# EasyEDA Pro project ProProject_Kame Quadrapot_2024-12-26.epro, board PCB1_1
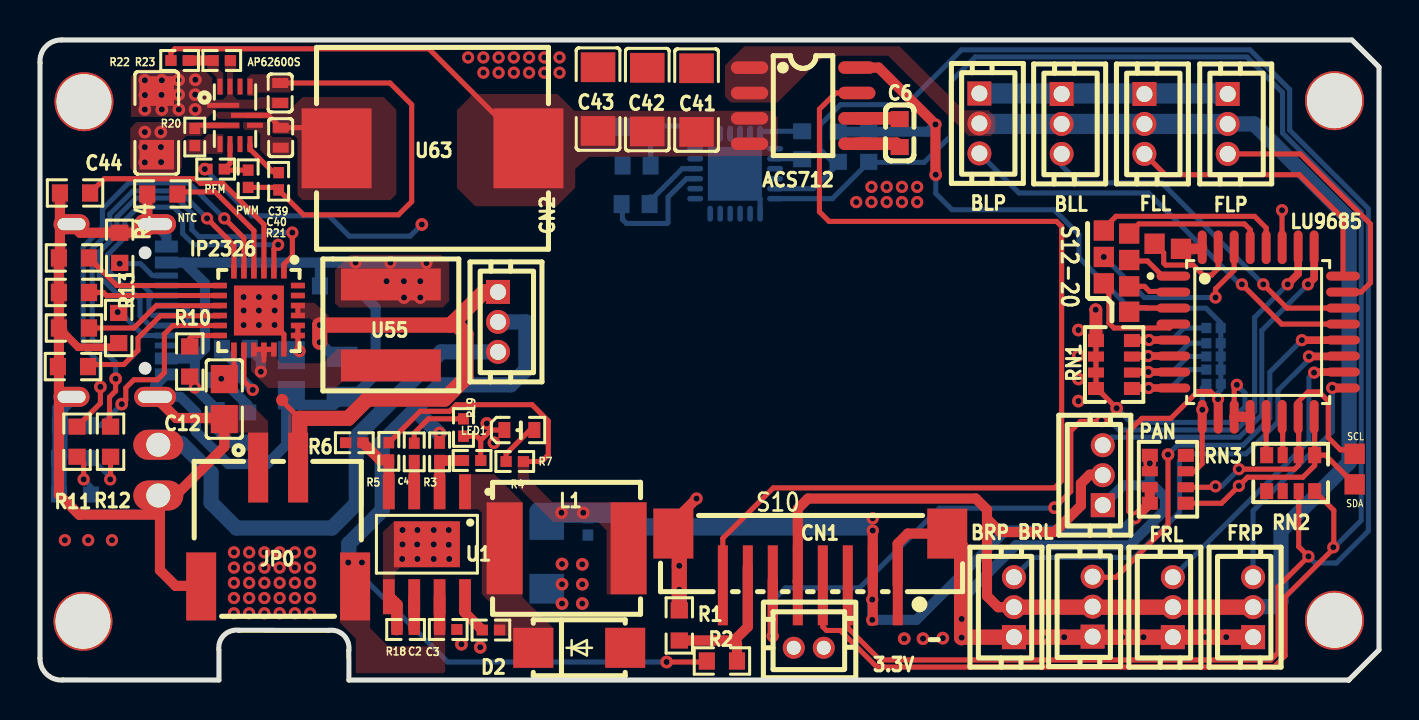
[diagram p5: board, top side]
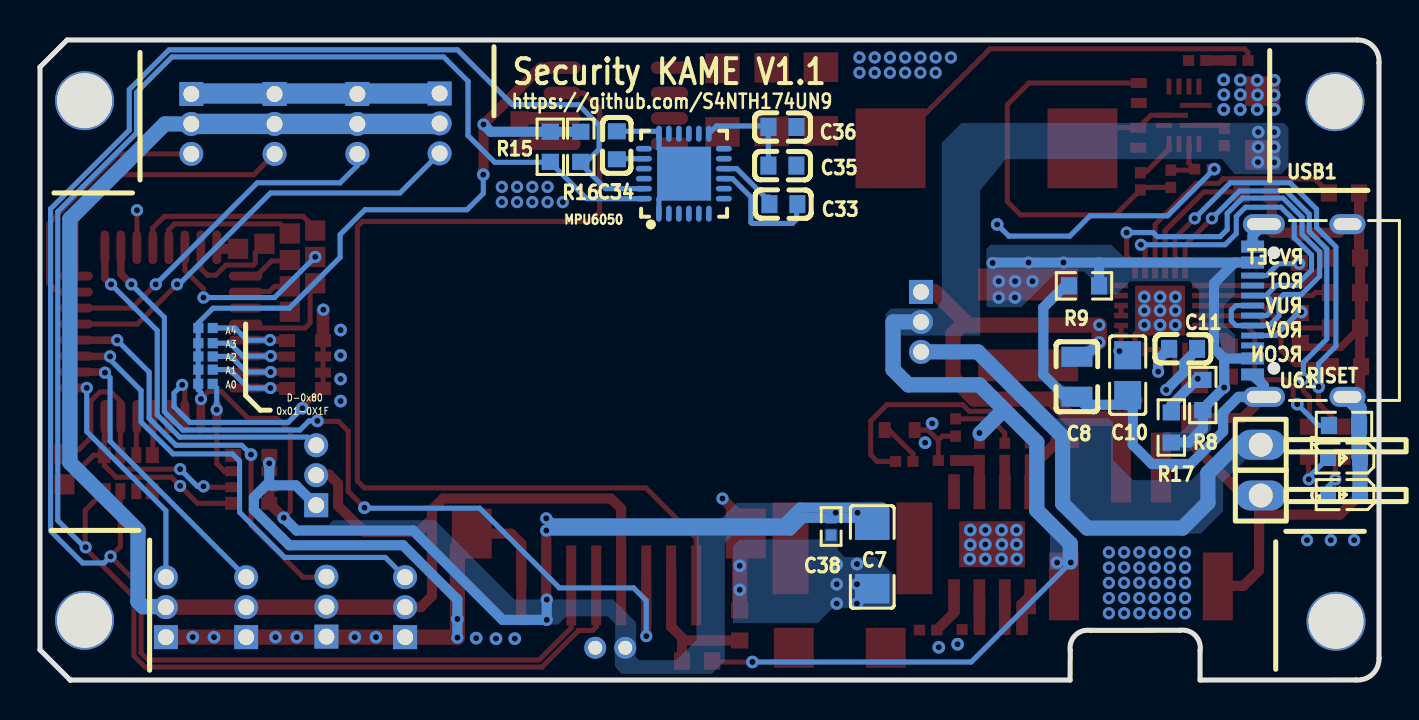
[diagram p6: board, bottom side, seen from below]

Outline 66.98 x 32.03 mm; copper layers: Top Layer, Bottom Layer. Coordinates in mm from the lower left corner of the outline.
Outline path: 65.47,0 15.45,0 15.45,1.49 arc(15.2,2.24) 14.45,2.49 9.95,2.49 arc(9.2,2.24) 8.95,1.49 8.95,0 1.14,0 arc(0.33,0.29) 0,1.09 0,30.89 arc(0.29,31.7) 1.09,32.03 65.62,32.03 66.98,30.67 66.98,1.51 65.47,0 ; 65.47,0 65.44,0
Stack: Top Layer 0.035mm - / Dielectric1 1.51mm FR4 er 4.5 / Bottom Layer 0.035mm -

## Design rules (mm)
template: Custom Config
spacing copperThickness1oz (default): track to track 0.102, other pairs 0.051 to 0.3
spacing copperThickness2oz: track to track 0.203, other pairs 0.152 to 0.3
track width copperThickness1oz (default): min 0.127, default 0.254, max 2.54
track width copperThickness2oz: min 0.203, default 0.254, max 2.54
differential pair differentialPair (default): width min 0.127, default 0.254, max 2.54; gap min 0.152, default 0.152
via viaSize (default): diameter min 0.5, default 0.61, max 10; hole min 0.3, default 0.305, max 6.299
net P_GND uses copperRegion1

## Placement (name value [footprint] x y rotation side)
3.3V  ZH1.5-2A  [CONN-TH_ZH-1.5-2A]  38.45 1.61 0 top
ACS712  ACS712ELCTR-05B-T-JSM  [SOP-8_L4.9-W3.9-P1.27-LS6.0-BL]  38.18 28.74 270 top
AP62600S  AP62600SJ-7  [QFN-12_L3.0-W2.0-P0.50-TL_AP62600SJ-7]  9.88 28.26 0 top
BLL  ZH1.5-3A  [CONN-TH_ZH1.5-3A_C2829733]  51.1 27.83 270 top
BLP  ZH1.5-3A  [CONN-TH_ZH1.5-3A_C2829733]  46.99 27.85 270 top
BRL  ZH1.5-3A  [CONN-TH_ZH1.5-3A_C2829733]  52.65 3.67 90 top
BRP  ZH1.5-3A  [CONN-TH_ZH1.5-3A_C2829733]  48.72 3.65 90 top
C2  10uF  [R0402]  20.42 2.53 180 top
C3  100nF  [R0402]  22.55 2.5 180 top
C4  220pF  [R0402]  18.72 11.42 270 top
C6  1nF  [C0603]  43 27.37 270 top
C7  22uF  [C1206]  25.35 6.16 90 bottom
C8  10uF  [C0805#2]  15.11 15.18 270 bottom
C10  22uF  [C0805]  12.57 15.25 270 bottom
C11  100nF  [C0603]  9.8 16.57 180 bottom
C12  10uF  [C0805]  9.22 14.06 90 top
C33  1u  [C0603]  29.79 23.81 180 bottom
C34  1u  [C0603]  38.12 26.76 90 bottom
C35  10u  [C0603]  29.84 25.74 0 bottom
C36  1u  [C0603]  29.84 27.67 0 bottom
C38  100nF  [R0402]  27.41 7.68 90 bottom
C39  1uF  [C0402]  12.01 29.38 270 top
C40  100nF  [C0402]  12.04 27.14 270 top
C41  22uF  [C1206]  32.84 29.02 270 top
C42  22uF  [C1206]  30.38 29.05 270 top
C43  22uF  [C1206]  27.91 29.07 270 top
C44  22uF  [C1206]  5.84 27.88 270 top
CN1  8PIN_SMT(1.25MM)  [CONN-SMD_8PIN_SMT-P1.25]  38.53 6.03 180 top
CN2  -  [CONN-TH_ZH1.5-3A_C2829733]  22.91 17.92 270 top
D2  SS34BF  [DO-214AC_L4.3-W2.7-LS5.2-RD]  26.97 1.61 0 top
FLL  ZH1.5-3A  [CONN-TH_ZH1.5-3A_C2829733]  55.24 27.83 270 top
FLP  ZH1.5-3A  [CONN-TH_ZH1.5-3A_C2829733]  59.41 27.83 270 top
FRL  ZH1.5-3A  [CONN-TH_ZH1.5-3A_C2829733]  56.67 3.65 90 top
FRP  ZH1.5-3A  [CONN-TH_ZH1.5-3A_C2829733]  60.68 3.65 90 top
G  LedRed_0603  [LED0603-RD_RED]  1.75 9.28 0 bottom
IP2326  IP2326_NPD  [QFN-24_L4.0-W4.0-P0.50-BL-EP2.5]  10.95 18.49 180 top
JP0  HDR-1X2  [CONN-SMD_PH2.0MM-2AWB]  11.91 7.66 0 top
L1  10uH  [IND-SMD_L7.4-W6.6_ECS-MPIL0630]  26.34 6.59 0 top
LED1  0603  [LED0603-R-RD_MINI]  23.98 12.51 0 top
LU9685  LU9685-20CU  [LQFP-32_L7.0-W7.0-P0.80-LS9.0-BL]  60.93 17.41 270 top
MPU6050  MPU6050-YJLTY  [QFN-24_L4.0-W4.0-P0.50-BL-EP2.7]  34.77 25.34 180 bottom
NOREF  -  [Pad_e13528]  58.34 15.53 180 top
NOREF#2  -  [Pad_e13532]  58.34 16.85 180 top
NOREF#3  -  [Pad_e13531]  59.06 16.19 180 top
NOREF#4  -  [Pad_e2339]  54.48 18.43 180 top
NOREF#5  -  [Pad_e75]  64.75 2.99 0 top
NOREF#6  -  [Pad_e2336]  54.48 21.02 180 top
NOREF#7  -  [Pad_e73]  2.15 2.94 0 top
NOREF#8  -  [Pad_e71]  2.2 28.94 0 top
NOREF#9  -  [Pad_e2335]  53.21 21.17 180 top
NOREF#10  -  [Pad_e13533]  59.06 16.85 180 top
NOREF#11  -  [Pad_e2310]  54.48 22.34 180 top
NOREF#12  -  [Pad_e2378]  65.76 9.79 180 top
NOREF#13  -  [Pad_e2297]  53.21 22.49 180 top
NOREF#14  -  [Pad_e2337]  53.21 19.85 180 top
NOREF#15  -  [Pad_e13535]  59.06 17.62 180 top
NOREF#16  -  [Pad_e13526]  59.06 14.82 180 top
NOREF#17  -  [Pad_e77]  64.75 28.99 0 top
NOREF#18  -  [Pad_e13530]  58.34 16.19 180 top
NOREF#19  -  [Pad_e13525]  58.34 14.82 180 top
NOREF#20  -  [Pad_e13534]  58.34 17.62 180 top
NOREF#21  -  [Pad_e2405]  12.11 14.01 0 top
NOREF#22  -  [Pad_e2377]  65.76 11.32 180 top
NOREF#23  -  [Pad_e2321]  55.75 21.83 180 top
NOREF#24  -  [Pad_e2338]  54.48 19.7 180 top
NOREF#25  -  [Pad_e13529]  59.06 15.53 180 top
NOREF#26  -  [Pad_e2322]  57.07 21.58 180 top
NTC  51KΩ  [R0603]  6.12 24.32 0 top
PAN  ZH1.5-3A  [CONN-TH_ZH1.5-3A_C2829733]  53.16 10.25 90 top
PFM  JP  [R0402]  8.79 25.57 0 top
PWM  JP  [R0402]  10.41 25.08 270 top
R  LedGreen_0603  [LED0603-RD_GREEN]  1.75 11.11 0 bottom
R1  10kΩ  [R0603]  31.98 2.73 90 top
R2  15kΩ  [R0603]  34.11 0.95 0 top
R3  24K  [R0402]  19.99 11.42 270 top
R4  100K  [R0402]  21.61 10.99 0 top
R5  3V3=124/40.2  [R0402]  17.45 11.44 270 top
R6  40.2K  [R0402]  15.72 11.88 180 top
R7  2K2  [R0402]  23.75 10.94 180 top
R8  1Ω  [R0603]  8.81 14.26 270 bottom
R9  5.1kΩ  [R0603]  14.76 19.72 180 bottom
R10  5.1kΩ  [R0603]  7.49 15.94 90 top
R11  1kΩ  [R0603]  1.85 11.93 90 top
R12  1kΩ  [R0603]  3.53 11.93 90 top
R13  5.1kΩ  [R0603]  3.94 17.62 270 top
R14  5.1kΩ  [R0603]  3.99 21.63 270 top
R15  2.2K  [R0603]  41.45 26.68 90 bottom
R16  2.2K  [R0603]  39.93 26.68 90 bottom
R17  1Ω  [R0603]  10.39 12.64 270 bottom
R18  200K  [R0402]  18.29 2.53 180 top
R19  68.1K  [R0402]  21.18 12.64 270 top
R20  100k  [R0402]  7.74 27.17 270 top
R21  100k  [R0402]  11.94 24.96 90 top
R22  221k  [R0402]  6.98 31 0 top
R23  30.1k  [R0402]  9.09 31 0 top
RCON  1k  [R0603]  1.65 15.68 0 top
RISET  75k  [R0603]  1.75 12.74 0 bottom
RN1  4.7kΩ  [RES-ARRAY-SMD_0603-8P-L3.2-W1.6-BL]  53.72 15.79 270 top
RN2  220Ω  [RES-ARRAY-SMD_0603-8P-L3.2-W1.6-BL]  62.56 10.35 0 top
RN3  4.7kΩ  [RES-ARRAY-SMD_0603-8P-L3.2-W1.6-BL]  56.41 10.05 270 top
ROT  120K  [R0603]  1.7 21.12 0 top
ROV  NC  [R0603]  1.7 17.62 0 top
RUV  1k  [R0603]  1.7 19.39 0 top
RVSET  NC  [R0603]  1.75 24.37 180 top
U1  MP1584EN-LF-Z  [SOP-8_L4.9-W3.9-P1.27-LS6.0-BL-EP3.3-2]  19.35 6.8 180 top
U55  2.2uH  [IND-SMD_L6.7-W6.5]  17.55 17.77 90 top
U61  PH2.0-2P  [2.54mm_1*2P_oval]  5.92 9.23 0 bottom
U63  1.5uH  [IND-SMD_L11.6-W10.1]  19.63 26.61 0 top
USB1  TYPEC-304A-ACP16O  [USB-SMD_TYPEC-304A-ACP16O]  3.95 18.49 90 bottom

## Footprints (pads in the part's own frame, mm; a bottom-side part is the same pattern mirrored in y, then rotated)
2.54mm_1*2P_oval
  oval 2.5x1.5 hole 1.2: 1(0,0) 2(0,-2.54)
C0402
  rect 0.5x0.8 smd: 1(-0.5,0) 2(0.5,0)
C0603
  rect 0.8x0.9 smd: 1(-0.7,0) 2(0.7,0)
C0805
  rect 1.41x1.35 smd: 1(-1,0) 2(1,0)
C0805#2
  rect 1x1.55 smd: 1(-1,0) 2(1,0)
C1206
  rect 1.485x1.728 smd: 1(-1.593,0) 2(1.593,0)
CONN-SMD_8PIN_SMT-P1.25
  rect 0.5x4 smd: 1(-4.375,1.295) 2(-3.125,1.295) 3(-1.875,1.295) 4(-0.625,1.295) 5(0.625,1.295) 6(1.875,1.295) 7(3.125,1.295) 8(4.375,1.295)
  rect 2x2.5 smd: 9(6.85,-1.295) 10(-6.85,-1.295)
CONN-SMD_PH2.0MM-2AWB
  rect 1x3.5 smd: 1(-1,2.975) 2(1,2.975)
  rect 1.5x3.4 smd: 3(3.85,-2.975) 4(-3.85,-2.975)
CONN-TH_ZH1.5-3A_C2829733
  rect 1.2x1.2 hole 0.8: 1(-1.5,0)
  round 1.2 hole 0.8: 2(0,0) 3(1.5,0)
CONN-TH_ZH-1.5-2A
  round 1.1 hole 0.7: 1(-0.75,0) 2(0.75,0)
DO-214AC_L4.3-W2.7-LS5.2-RD
  rect 2x2 smd: 1(-2.3,0) 2(2.3,0)
IND-SMD_L6.7-W6.5
  rect 1.6x5 smd: 1(-2.025,0) 2(2.025,0)
IND-SMD_L7.4-W6.6_ECS-MPIL0630
  rect 1.8x4.6 smd: 1(-3.1,0) 2(3.1,0)
IND-SMD_L11.6-W10.1
  rect 3.5x4 smd: 1(-4.8,0) 2(4.8,0)
LED0603-R-RD_MINI
  rect 0.6x0.8 smd: 1(0.75,0) 2(-0.75,0)
LED0603-RD_GREEN
  rect 0.8x0.8 smd: 1(-0.799,-0.004) 2(0.799,0.004)
LED0603-RD_RED
  rect 0.8x0.8 smd: 1(-0.799,-0.004) 2(0.799,0.004)
LQFP-32_L7.0-W7.0-P0.80-LS9.0-BL
  oval 0.448x1.684 smd: 1(-2.8,-4.242) 2(-2,-4.242) 3(-1.2,-4.242) 4(-0.4,-4.242) 5(0.4,-4.242) 6(1.2,-4.242) 7(2,-4.242) 8(2.8,-4.242) 17(2.8,4.242) 18(2,4.242) 19(1.2,4.242) 20(0.4,4.242) 21(-0.4,4.242) 22(-1.2,4.242) 23(-2,4.242) 24(-2.8,4.242)
  oval 1.684x0.448 smd: 9(4.242,-2.8) 10(4.242,-2) 11(4.242,-1.2) 12(4.242,-0.4) 13(4.242,0.4) 14(4.242,1.2) 15(4.242,2) 16(4.242,2.8) 25(-4.242,2.8) 26(-4.242,2) 27(-4.242,1.2) 28(-4.242,0.4) 29(-4.242,-0.4) 30(-4.242,-1.2) 31(-4.242,-2) 32(-4.242,-2.8)
Pad_e71
  round 2.95 hole 2.75: 1(0,0)
Pad_e73
  round 2.95 hole 2.75: 2(0,0)
Pad_e75
  round 2.95 hole 2.75: 4(0,0)
Pad_e77
  round 2.95 hole 2.75: 3(0,0)
Pad_e2297
  rect 1.016x1.016 smd: 6(0,0)
Pad_e2310
  rect 1.016x1.016 smd: 6(0,0)
Pad_e2321
  rect 1.016x1.016 smd: 6(0,0)
Pad_e2322
  rect 1.016x1.016 smd: 6(0,0)
Pad_e2335
  rect 1.016x1.016 smd: 6(0,0)
Pad_e2336
  rect 1.016x1.016 smd: 6(0,0)
Pad_e2337
  rect 1.016x1.016 smd: 6(0,0)
Pad_e2338
  rect 1.016x1.016 smd: 6(0,0)
Pad_e2339
  rect 1.016x1.016 smd: 6(0,0)
Pad_e2377
  rect 1.016x1.016 smd: 6(0,0)
Pad_e2378
  rect 1.016x1.016 smd: 6(0,0)
Pad_e2405
  round 0.61 smd: TP1(0,0)
Pad_e13525
  rect 0.508x0.508 smd far side: 6(0,0)
Pad_e13526
  rect 0.508x0.508 smd far side: 6(0,0)
Pad_e13528
  rect 0.508x0.508 smd far side: 6(0,0)
Pad_e13529
  rect 0.508x0.508 smd far side: 6(0,0)
Pad_e13530
  rect 0.508x0.508 smd far side: 6(0,0)
Pad_e13531
  rect 0.508x0.508 smd far side: 6(0,0)
Pad_e13532
  rect 0.508x0.508 smd far side: 6(0,0)
Pad_e13533
  rect 0.508x0.508 smd far side: 6(0,0)
Pad_e13534
  rect 0.508x0.508 smd far side: 6(0,0)
Pad_e13535
  rect 0.508x0.508 smd far side: 6(0,0)
QFN-12_L3.0-W2.0-P0.50-TL_AP62600SJ-7
  rect 1.6x0.25 smd: 1(-0.715,0.501) 2(-0.715,-0.499) 8(0.475,0.002)
  rect 0.25x0.8 smd: 3(-0.875,-1.44) 4(-0.375,-1.44) 5(0.125,-1.44) 6(0.625,-1.44) 9(0.625,1.44) 10(0.126,1.44) 11(-0.375,1.44) 12(-0.875,1.44)
  rect 0.8x0.25 smd: 7(0.875,-0.499)
QFN-24_L4.0-W4.0-P0.50-BL-EP2.5
  rect 0.28x0.7 smd: 1(-1.25,-1.95) 2(-0.75,-1.95) 3(-0.25,-1.95) 4(0.25,-1.95) 5(0.75,-1.95) 6(1.25,-1.95) 13(1.25,1.95) 14(0.75,1.95) 15(0.25,1.95) 16(-0.25,1.95) 17(-0.75,1.95) 18(-1.25,1.95)
  rect 0.7x0.28 smd: 7(1.95,-1.25) 8(1.95,-0.75) 9(1.95,-0.25) 10(1.95,0.25) 11(1.95,0.75) 12(1.95,1.25) 19(-1.95,1.25) 20(-1.95,0.75) 21(-1.95,0.25) 22(-1.95,-0.25) 23(-1.95,-0.75) 24(-1.95,-1.25)
  rect 2.5x2.5 smd: 25(0,0)
QFN-24_L4.0-W4.0-P0.50-BL-EP2.7
  oval 0.28x0.8 smd: 1(-1.25,-2) 2(-0.75,-2) 3(-0.25,-2) 4(0.25,-2) 5(0.75,-2) 6(1.25,-2) 13(1.25,2) 14(0.75,2) 15(0.25,2) 16(-0.25,2) 17(-0.75,2) 18(-1.242,2)
  oval 0.8x0.28 smd: 7(2,-1.25) 8(2,-0.75) 9(2,-0.25) 10(2,0.25) 11(2,0.75) 12(2,1.25) 19(-2,1.25) 20(-2,0.75) 21(-2,0.25) 22(-2,-0.25) 23(-2,-0.75) 24(-2,-1.25)
  rect 2.7x2.7 smd: 25(0.013,0)
R0402
  rect 0.566x0.54 smd: 1(-0.433,0) 2(0.433,0)
R0603
  rect 0.806x0.864 smd: 1(-0.753,0) 2(0.753,0)
RES-ARRAY-SMD_0603-8P-L3.2-W1.6-BL
  rect 0.65x0.8 smd: 1(-1.2,-0.9) 4(1.2,-0.9) 5(1.2,0.9) 8(-1.2,0.9)
  rect 0.5x0.8 smd: 2(-0.4,-0.9) 3(0.4,-0.9) 6(0.4,0.9) 7(-0.4,0.9)
SOP-8_L4.9-W3.9-P1.27-LS6.0-BL
  oval 0.63x1.865 smd: 1(-1.905,-2.683) 2(-0.635,-2.683) 3(0.635,-2.683) 4(1.905,-2.683) 5(1.905,2.683) 6(0.635,2.683) 7(-0.635,2.683) 8(-1.905,2.683)
SOP-8_L4.9-W3.9-P1.27-LS6.0-BL-EP3.3-2
  rect 0.589x1.75 smd: 1(-1.905,-2.626) 2(-0.635,-2.626) 3(0.635,-2.626) 4(1.905,-2.626) 5(1.905,2.626) 6(0.635,2.626) 7(-0.635,2.626) 8(-1.905,2.626)
  rect 3.3x2.3 smd: 9(0,0)
USB-SMD_TYPEC-304A-ACP16O
  oval 1x2.1 hole 0.6x1.7: 12(-4.32,1.808) 13(4.32,1.808)
  oval 1x1.8 hole 0.6x1.4: 14(-4.32,-2.373) 15(4.32,-2.373)
  rect 0.6x1.15 smd: A1B12(-3.2,2.373) A4B9(-2.4,2.373) B1A12(3.2,2.373) B4A9(2.4,2.373)
  rect 0.3x1.15 smd: A5(-1.25,2.373) A6(-0.25,2.373) A7(0.25,2.373) A8(1.25,2.373) B5(1.75,2.373) B6(0.75,2.373) B7(-0.75,2.373) B8(-1.75,2.373)

## Nets
5V: ACS712.3 ACS712.4 C41.2 C42.2 C43.2 R22.1 U63.2
+5V: ACS712.1 ACS712.2 BLL.2 BLP.2 BRL.2 BRP.2 CN1.5 FLL.2 FLP.2 FRL.2 FRP.2 PAN.2
DVCC: 3.3V.1 ACS712.8 C7.2 C38.2 CN1.2 L1.2 LU9685.10 NOREF#3.6 NOREF#10.6 NOREF#15.6 NOREF#16.6 NOREF#25.6 R5.1 R7.1 R15.2 R16.2 RN3.3 RN3.4
GND: 3.3V.2
VIN: R8.2 R9.2 R10.1 R17.2 U55.2 USB1.A4B9 USB1.B4A9
A0: LU9685.9 NOREF#19.6 RN3.7
A1: LU9685.8 NOREF.6 RN1.5
A2: LU9685.7 NOREF#18.6 RN1.6
A3: LU9685.6 NOREF#2.6 RN1.7
A4: LU9685.5 NOREF#20.6 RN1.8
BAT: C8.1 CN2.1 IP2326.21 IP2326.22 JP0.2 NOREF#21.TP1
BAT+: AP62600S.2 C2.2 C44.2 CN2.2 JP0.3 R2.1 R3.1 R20.1 U1.7
BT_SENSE: CN1.7 R1.1 R2.2
CUR_SEN: ACS712.7 CN1.8
DJ0: FRP.3 LU9685.17
DJ1: FRL.3 LU9685.18
DJ2: BRP.3 LU9685.19
DJ3: BRL.3 LU9685.20
DJ4: BLP.3 LU9685.21
DJ5: BLL.3 LU9685.22
DJ6: FLP.3 LU9685.23
DJ7: FLL.3 LU9685.24
DJ8: LU9685.25 PAN.3
DJ9: CN1.6 LU9685.26
DJ10: LU9685.27
DJ11: LU9685.28 NOREF#13.6
DJ12: LU9685.29 NOREF#11.6
DJ13: LU9685.30 NOREF#9.6
DJ14: LU9685.31 NOREF#23.6
DJ15: LU9685.32 NOREF#26.6
DJ16: LU9685.1 NOREF#6.6
DJ17: LU9685.2 NOREF#24.6
DJ18: LU9685.3 NOREF#4.6
DJ19: LU9685.4 NOREF#14.6
DM: IP2326.1 USB1.A7 USB1.B7
DP: IP2326.2 USB1.A6 USB1.B6
P_GND: ACS712.5 AP62600S.1 AP62600S.11 BLL.1 BLP.1 BRL.1 BRP.1 C2.1 C6.2 C7.1 C8.2 C10.2 C12.1 C33.2 C34.2 C35.1 C36.1 C38.1 C39.2 C41.1 C42.1 C43.1 C44.1 CN1.1 CN1.9 CN1.10 D2.2 FLL.1 FLP.1 FRL.1 FRP.1 G.1 IP2326.18 IP2326.25 JP0.1 JP0.4 LED1.2 LU9685.11 LU9685.12 MPU6050.1 MPU6050.9 MPU6050.18 MPU6050.25 NTC.1 PAN.1 PFM.1 R.1 R1.2 R4.2 R6.2 R9.1 R13.2 R14.1 R18.2 R19.2 R23.2 RCON.1 RISET.1 RN1.1 RN1.2 RN1.3 RN1.4 RN3.1 RN3.2 ROT.1 ROV.1 RUV.1 RVSET.2 U1.5 U1.9 U61.1 USB1.12 USB1.13 USB1.14 USB1.15 USB1.A1B12 USB1.B1A12
RXD: RN2.1
SCL: CN1.3 MPU6050.23 R16.1 RN2.3
SDA: CN1.4 MPU6050.24 R15.1 RN2.4
TXD: RN2.2
$1N2: LU9685.16 NOREF#12.6 RN2.5 RN3.5
$1N6832: LU9685.14 RN2.7
$1N6846: LU9685.13 RN2.8
$1N6878: LU9685.15 NOREF#22.6 RN2.6 RN3.6
$1N9487: C10.1 IP2326.19 IP2326.20
$1N9489: C11.2 IP2326.14
$1N9490: C11.1 IP2326.15 IP2326.16 IP2326.17 U55.1
$1N9492: C12.2 IP2326.13 R8.1 R17.1
$1N9496: R14.2 USB1.B5
$1N9497: R13.1 USB1.A5
$1N9501: IP2326.4 NTC.2
$1N9502: IP2326.5 R11.2
$1N9503: IP2326.6 R12.2
$1N9504: R.2 R12.1
$1N9505: G.2 R11.1
$1N9508: IP2326.10 RCON.2
$1N9510: IP2326.8 RUV.2
$1N9511: IP2326.7 ROT.2
$1N9512: IP2326.11 RISET.2
$1N9513: IP2326.12 R10.2
$1N13576: IP2326.9 ROV.2
$1N15007: ACS712.6 C6.1
$1N16837: IP2326.3 RVSET.1
$1N21828: C34.1 MPU6050.20
$1N21877: C35.2 C36.2 MPU6050.13
$1N25378: C33.1 MPU6050.10
$1N28770: CN2.3 U61.2
$1N32350: C3.1 D2.1 L1.1 U1.1
$1N32352: R18.1 U1.6
$1N32353: R5.2 R6.1 U1.4
$1N32354: C3.2 U1.8
$1N32356: R3.2 R4.1 U1.2
$1N32357: C4.2 U1.3
$1N32372: C4.1 R19.1
$1N32894: AP62600S.3 R20.2
$1N32978: AP62600S.6 R21.2
$1N33107: AP62600S.7 C40.2
$1N33225: AP62600S.8 C40.1 U63.1
$1N35395: AP62600S.12 R22.2 R23.1
$1N42685: AP62600S.4 PFM.2 PWM.1
$1N42697: AP62600S.9 C39.1 PWM.2 R21.1
$1N46249: LED1.1 R7.2

Pads without a net: AP62600S 5 10; IP2326 23 24; MPU6050 2 3 4 5 6 7 8 11 12 14 15 16 17 19 21 22; NOREF#5 4; NOREF#7 2; NOREF#8 1; NOREF#17 3; RN3 8; USB1 A8 B8

## Via types
v1: diameter 0.61, hole 0.305, Top Layer to Bottom Layer, 104 vias
v2: diameter 0.635, hole 0.305, Top Layer to Bottom Layer, 89 vias

## Routing (per net, layer and track width the routed paths; a pad name or vN(x,y) marks a point on that pad's centre or on a via; arc(x,y) is an arc through that point)
5V: length 20.4
  Top Layer w0.254: U63.2 19.45,31.59 6.74,31.59 6.55,31.4 R22.1
+5V: length 81.9
  Top Layer w0.508: 47.37,8.06 48.03,7.41 50.75,7.41 52.07,8.73 52.07,9.83 52.51,10.27 53.21,10.27 ; 47.37,8.06 47.37,8.52 46.81,9.08 38.42,9.08 37.91,8.57 37.91,4.92 37.9,4.91 ; 47.37,8.06 47.37,4.2 47.93,3.65 BRP.2
  Top Layer w0.762: FRP.2 FRL.2 BRP.2
  Bottom Layer w0.762: FLP.2 60.73,27.83 65.48,23.08 65.48,10.88 62.08,7.48 62.08,3.92 61.82,3.67 60.7,3.67 FRP.2
  Bottom Layer w1.016: BLP.2 47.01,27.83 BLL.2 FLL.2 FLP.2
DVCC: length 112.2
  Top Layer w0.254: v1(58.93,14.06) 58.55,14.44 57.91,14.44 56.56,13.09 55.12,13.09 54.46,12.43 54.46,8.45 v2(54.79,8.12) ; R7.1 25.09,10.94 25.42,11.27 25.42,12.97 24.61,13.78 20.83,13.78 20.5,13.45 19.02,13.45 R5.1
  Top Layer w0.508: v1(41.65,7.48) 41.65,4.69 ; v2(44.8,25.29) 44.79,25.3 v1(44.79,27.8) 41.95,30.65 ACS712.8 ; v2(54.79,8.12) 54.79,8.12 RN3.4 RN3.3
  Bottom Layer w0.254: v1(58.93,14.06) 58.93,14.39 59.06,14.53 NOREF#16.6 59.06,17.61 ; 59.06,17.61 59.06,17.87 58.32,18.61 54.51,18.61 51.97,21.15 51.97,22.29 50.72,23.53 45.62,23.53 44.8,24.35 v2(44.8,25.29) ; 59.06,17.61 NOREF#15.6
  Bottom Layer w0.508: v1(41.65,8.09) 41.4,7.84 29.77,7.84 28.98,8.62 24.84,8.62 24.74,8.52 ; v1(41.63,4.03) v1(41.63,3.01) 43.84,3.01 48.31,7.48 54.15,7.48 v2(54.79,8.12) ; v1(41.65,7.48) 29.44,7.48 28.8,8.12 C38.2 25.71,8.12 25.35,7.75 ; v1(44.79,27.8) 44.43,27.44 R15.2 R16.2
  vias: v2(26.08,8.37) v2(27.18,8.37)
VIN: length 26.9
  Bottom Layer w0.508: R9.2 14,20.88 14.01,20.89 ; R17.2 9.52,11.88 8.81,12.59 R8.2 8.81,13.57 v1(7.75,14.63) 7.75,16.09 ; 14.01,20.89 v1(15.78,20.89) v1(17.53,20.89) 19.31,20.89 v1(19.33,20.87) ; 14.01,20.89 10.08,20.89 ; 7.75,16.09 8.25,16.6 8.25,19.85 7.21,20.89 ; 7.75,16.09 6.33,16.09 ; USB1.B4A9 7.21,20.89 ; 7.21,20.89 10.08,20.89 ; 10.09,20.88 10.08,20.89
  vias: v2(17.33,19.96) v2(18.2,19.96) v2(18.21,19.14) v2(19.02,19.96) v2(19.02,19.14)
A0: length 5.1
  Top Layer w0.254: RN3.7 57.33,10.43 57.73,10.43 58.13,10.83 58.13,13.17 58.14,13.18 v1(58.14,13.53)
  Bottom Layer w0.254: v1(58.14,13.53) 58.14,14.62 NOREF#19.6
A1: length 5.3
  Top Layer w0.381: 54.62,14.64 54.65,14.61 v1(55.45,14.61) LU9685.8
  Bottom Layer w0.254: NOREF.6 57.48,15.53 56.56,14.61 v1(55.45,14.61)
A2: length 5.3
  Top Layer w0.381: 54.62,15.44 54.65,15.41 v1(55.44,15.41) LU9685.7
  Bottom Layer w0.254: NOREF#18.6 57.43,16.19 56.65,15.41 v1(55.44,15.41)
A3: length 5.3
  Top Layer w0.381: 54.62,16.24 54.65,16.21 v1(55.43,16.21) LU9685.6
  Bottom Layer w0.254: NOREF#2.6 57.48,16.85 56.84,16.21 v1(55.43,16.21)
A4: length 5.2
  Top Layer w0.381: 54.62,17.04 54.65,17.01 v1(55.47,17.01) LU9685.5
  Bottom Layer w0.254: v1(55.47,17.01) 55.48,17.01 56.62,17.01 57.22,17.62 NOREF#20.6
BAT: length 27.7
  Top Layer w0.254: NOREF#21.TP1 12.11,13.96 12.98,13.09 ; IP2326.21 IP2326.22
  Top Layer w0.762: 20.7,17.92 21.31,17.31 21.31,15.13 20.24,14.06 16.38,14.06 15.42,13.09 12.98,13.09 12.98,11.24 ; 20.7,17.92 20.54,17.76 v1(13.99,17.76) v1(13.99,16.9) ; 20.7,17.92 22.2,19.42 CN2.1
  Bottom Layer w0.508: C8.1 14.72,16.18 v1(13.99,16.9)
BAT+: length 44
  Top Layer w0.254: 9.16,27.76 7.91,27.76 7.75,27.6 ; R2.1 33.31,0.9 v2(31.34,0.9)
  Top Layer w0.584: 19.99,2.55 U1.7
  Bottom Layer w0.254: v2(15.42,5.88) 20.4,0.9 v2(31.34,0.9)
  Bottom Layer w0.762: 18.75,13.54 17.12,11.9 17.12,8.5 15.44,6.82 15.44,5.9 ; 18.75,13.54 19.96,12.33 ; 18.75,13.54 19.99,14.77 23.54,14.77 24.31,15.53 24.31,17.92 CN2.2
  vias: v2(5.24,27.42) v2(5.24,26.67) v2(5.24,25.9) v2(6.04,27.42) v2(6.05,26.67) v2(6.06,25.92) v2(16.1,5.88) v2(19.99,12.36)
BT_SENSE: length 7.8
  Top Layer w0.508: R2.2 34.86,1.83 34.72,1.98 ; 35.41,5.65 35.41,2.66 34.72,1.98 ; 34.72,1.98 R1.1
CUR_SEN: length 53
  Top Layer w0.254: ACS712.7 39.8,29.38 38.99,28.57 38.99,23.43 39.47,22.95 50.85,22.95 51.1,22.7 51.1,9.97 50.75,9.61 36.68,9.61 34.16,7.09 CN1.8
DJ0: length 11.7
  Top Layer w0.254: v1(64.64,14.62) 64.65,14.61 LU9685.17
  Bottom Layer w0.254: v1(64.64,14.62) 64.64,12.43 60.68,8.47 FRP.3
DJ1: length 14.6
  Top Layer w0.381: LU9685.18 63.76,15.41 v1(63.73,15.38)
  Bottom Layer w0.254: v1(63.73,15.38) 63.47,15.13 63.47,11.95 FRL.3
DJ2: length 23.6
  Top Layer w0.381: v1(63.47,16.19) 65.16,16.19 LU9685.19
  Bottom Layer w0.254: BRP.3 49.71,6.13 54.74,6.13 57,8.4 57,10.96 57.35,11.32 60.32,11.32 61.92,12.92 61.92,14.49 63.47,16.04 v1(63.47,16.19)
DJ3: length 20.9
  Top Layer w0.254: v2(56.42,11.28) 56.42,7.74 53.82,5.14 52.68,5.14 BRL.3
  Top Layer w0.381: v1(63.12,17.01) 65.17,17.01 LU9685.20
  Bottom Layer w0.254: v2(56.42,11.28) 56.89,11.75 60.17,11.75 61.52,13.09 61.52,15.41 v1(63.12,17.01)
DJ4: length 21.7
  Top Layer w0.254: LU9685.21 62.11,17.81 v1(60.12,19.8)
  Bottom Layer w0.254: v1(60.12,19.8) 60.02,19.8 55.45,24.37 48.97,24.37 BLP.3
DJ5: length 17.6
  Top Layer w0.254: v1(61.19,19.8) 62.38,18.61 LU9685.22
  Bottom Layer w0.254: BLL.3 51.1,25.74 51.97,24.88 56.11,24.88 v1(61.19,19.8)
DJ6: length 13.1
  Top Layer w0.254: FLP.3 63.04,26.33 66.55,22.82 66.55,19.88 66.08,19.41 LU9685.23
DJ7: length 14.2
  Top Layer w0.254: LU9685.24 65.18,23.1 62.99,25.29 56.28,25.29 FLL.3
DJ8: length 18
  Top Layer w0.381: v1(63.42,19.8) 63.73,20.11 LU9685.25
  Bottom Layer w0.254: v1(63.42,19.8) 61.11,17.49 61.11,13.28 59.99,12.15 53.59,12.15 53.21,11.77
DJ9: length 43.9
  Top Layer w0.254: v2(53.1,12.97) 53.08,12.94 52.04,12.94 51.56,12.46 51.56,9.44 v2(50.75,8.62)
  Top Layer w0.381: v1(62.41,19.8) 62.93,20.33 LU9685.26
  Top Layer w0.508: 36.65,4.99 v1(36.65,2.2)
  Bottom Layer w0.254: v1(36.65,2.2) 36.65,3.98 37.29,4.61 40.99,4.61 44.98,8.6 50.72,8.6 v2(50.75,8.62) ; v2(53.1,12.97) 53.52,12.97 53.97,12.51 59.84,12.51 60.76,13.42 60.76,18.15 v1(62.41,19.8)
DJ10: length 1.9
  Top Layer w0.254: v1(62.13,23.51) 62.13,21.66 62.13,21.65
DJ11: length 9.5
  Top Layer w0.254: 53.57,22.54 53.57,22.95 53.82,23.2 60.75,23.2 61.33,22.62 LU9685.28
DJ12: length 7.3
  Top Layer w0.254: LU9685.29 60.53,22.54 60.25,22.82 54.96,22.82 NOREF#11.6
DJ13: length 9.3
  Top Layer w0.254: LU9685.30 59.73,20.5 58.8,19.57 v1(58.8,19.14)
  Bottom Layer w0.254: v1(53.21,21.17) 55.24,19.14 v1(58.8,19.14)
DJ14: length 5.3
  Top Layer w0.254: LU9685.31 58.93,20.59 58.6,20.26 58.19,20.26 57.68,20.77 56.31,20.77 56.21,20.87 56.21,21.38 NOREF#23.6
DJ15: length 1.1
  Top Layer w0.508: 58.13,21.65 58.06,21.58 NOREF#26.6
DJ16: length 2.5
  Top Layer w0.254: LU9685.1 56.15,20.21 55.4,20.97 54.53,20.97 NOREF#6.6
DJ17: length 2.3
  Top Layer w0.254: NOREF#24.6 55.24,19.7 55.5,19.44 56.66,19.44 LU9685.2
DJ18: length 2.3
  Top Layer w0.254: NOREF#4.6 54.69,18.63 55.35,18.63 55.36,18.61 LU9685.3
DJ19: length 5.5
  Top Layer w0.254: LU9685.4 56.49,17.62 53.72,17.62 53.47,17.87 53.47,19.6 NOREF#14.6
DM: length 23.7
  Top Layer w0.254: v1(12.62,22.39) 12.62,21.22 12.2,20.8 IP2326.1
  Bottom Layer w0.254: v1(12.62,22.39) 11.3,22.39 11.1,22.19 7.95,22.19 7.59,22.54 7.59,23.36 6.83,24.12 4.8,24.12 3.85,23.16 3.85,22.3 2.97,21.43 2.97,20.21 3.89,19.29 4.77,19.29 5,19.06 5,18.22 5.49,17.74 USB1.B7 7.16,17.74 7.39,17.97 7.39,18.51 7.16,18.74 USB1.A7
DP: length 18.8
  Top Layer w0.254: v1(11.91,21.78) 11.7,21.57 IP2326.2
  Bottom Layer w0.254: USB1.A6 5.62,18.24 5.45,18.41 5.45,19.04 5.65,19.24 ; 5.65,19.24 USB1.B6 ; 5.65,19.24 5.14,19.75 4.14,19.75 3.38,20.51 3.38,21.27 4.24,22.14 4.24,23 4.9,23.66 6.68,23.66 7.14,23.2 7.14,22.34 7.7,21.78 v1(11.91,21.78)
P_GND: length 192.2
  Top Layer w0.254: LU9685.11 59.73,14.64 v1(59.87,14.77) ; LED1.2 22.55,12.51 22.05,12 ; IP2326.18 12.2,17.3 v2(11.73,17.77) 11.01,18.49 v2(10.95,18.49) ; 22.05,12 21.84,12.2 R19.2 ; 22.05,12 R4.2 ; v2(53.86,13.6) 52.82,14.64 52.82,17.04
  Top Layer w0.381: R13.2 3.72,16.65 1.91,16.65 ROV.1
  Top Layer w0.508: LU9685.12 LU9685.11 ; RN3.2 v2(55.51,10.84) RN3.1 ; RVSET.2 1,21.17 ROT.1 RUV.1 ROV.1 0.95,9.29 1.96,8.27 6,8.27 ; 31.22,7.33 31.22,7.46 v1(32.84,9.08) ; 6,8.27 6,9.3 6.85,9.3 9.22,11.67 C12.1 9.27,13.11 6.82,13.11 USB1.12 ; 6,8.27 6,5.49 6.78,4.71 8.34,4.71 8.37,4.68 ; USB1.15 2.01,22.38 R14.1 5.33,22.38 USB1.13 5.37,23.2 NTC.1 ; 46.1,6.15 44.92,7.33 43.41,7.33 42.9,6.82 42.9,4.76
  Top Layer w0.584: R18.2 17.85,3.76 U1.5
  Top Layer w0.635: C6.2 42.83,26.84 ACS712.5 ; 52.82,17.04 52.82,18.52 v1(52.81,18.53)
  Top Layer w0.762: FRP.1 v2(59.34,2.15) v2(58.27,2.15) FRL.1 v2(55.2,2.15) v2(54.14,2.15) v2(51.23,2.15) v2(50.17,2.15) BRP.1 46.12,2.15 v1(46.1,2.12) v2(46.1,3.06) 46.1,6.61 CN1.10 ; CN1.9 31.98,7.03 v2(31.98,5.72) v2(31.98,4.52) R1.2
  Bottom Layer w0.254: 32.77,25.09 32.34,25.09 31.42,24.17 31.42,22.9 31.37,22.85 29.34,22.85 29.13,23.05 29.13,23.77 C33.2 ; v1(59.87,14.77) 60.27,14.36 60.27,13.68 59.49,12.89 54.57,12.89 v2(53.86,13.6) ; v2(8.24,25.57) 10.58,23.23 14.45,23.23 15.47,22.21 18.52,22.21 v2(19.1,22.8) ; 36.02,23.34 36.02,24.07 MPU6050.25 36.01,26.59 MPU6050.18 36.14,27.46 38.28,27.46
  Bottom Layer w0.508: 53.21,8.77 54.18,9.74 55.37,9.74 ; USB1.B1A12 6.32,22.24 USB1.13 ; 55.37,9.74 55.51,9.89 v2(55.51,10.84) ; 55.37,9.74 55.68,9.74 56.28,9.14 56.28,8.51 54.51,6.74 48.82,6.74 46.1,4.03 v2(46.1,3.06) v1(46.1,2.12) ; 15.74,19.69 16.79,18.64 16.79,15.28 15.69,14.18 C8.2 14.71,13.77 12.32,13.77 12.32,11.77 11.35,10.81 9.42,10.81 7.8,12.43 7.8,13.4 7.03,14.17 USB1.12 5.76,14.72 USB1.A1B12
  Bottom Layer w0.762: USB1.14 1,13.59 RISET.1 1,11.16 0.95,11.12 0.95,9.29
  Bottom Layer w1.016: FLP.1 59.38,29.35 BLP.1
  vias: v1(1.24,7) v1(2.41,7) v1(3.6,7) v1(9.7,6.39) v1(9.7,5.63) v1(9.7,4.86) v1(9.7,4.1) v1(9.7,3.34) v1(10.46,6.39) v1(10.46,5.63) v1(10.46,4.86) v1(10.46,4.1) v1(10.46,3.34) v1(11.23,6.39) v1(11.23,5.63) v1(11.23,4.86) v1(11.23,4.1) v1(11.23,3.34) v1(11.99,6.39) v1(11.99,5.63) v1(11.99,4.86) v1(11.99,4.1) v1(11.99,3.34) v1(12.75,6.39) v1(12.75,5.63) v1(12.75,4.86) v1(12.75,4.1) v1(12.75,3.34) v1(13.51,6.39) v1(13.51,5.63) v1(13.51,4.86) v1(13.51,4.1) v1(13.51,3.34) v1(21.42,31.15) v1(22.18,31.15) v1(22.18,30.39) v1(22.94,31.15) v1(22.94,30.39) v1(23.7,31.15) v1(23.7,30.39) v1(24.46,31.15) v1(24.46,30.39) v1(25.23,31.15) v1(25.23,30.39) v1(25.99,31.15) v1(25.99,30.39) v1(40.83,23.91) v1(41.59,24.68) v1(41.59,23.91) v1(42.35,24.68) v1(42.35,23.91) v1(43.11,24.68) v1(43.11,23.91) v1(43.88,24.68) v1(43.88,23.91) v2(5.24,30.01) v2(5.25,29.27) v2(5.24,28.55) v2(6.09,30.01) v2(6.08,29.28) v2(6.09,28.55) v2(6.93,30.02) v2(6.93,29.29) v2(6.94,28.55) v2(7.77,30.04) v2(7.76,29.29) v2(7.76,28.55) v2(10.18,19.16) v2(10.19,18.49) v2(10.19,17.76) v2(10.95,19.16) v2(10.95,17.76) v2(11.74,19.16) v2(11.74,18.49) v2(18.13,7.51) v2(18.13,6.79) v2(18.12,6.06) v2(18.88,7.51) v2(18.87,6.79) v2(18.88,6.06) v2(19.69,7.51) v2(19.69,6.79) v2(19.69,6.06) v2(20.45,7.51) v2(20.45,6.77) v2(20.47,6.06) v2(21.08,1.79) v2(22.02,1.64) v2(22.35,12.84) v2(22.71,11.88) v2(26.11,5.8) v2(26.11,4.79) v2(26.11,3.82) v2(27.13,5.79) v2(27.13,4.79) v2(27.13,3.83) v2(43.23,2.07) v2(44.17,2.07) v2(45.16,2.1) v2(51.94,17.51) v2(51.94,16.24) v2(51.94,15.06) v2(51.94,13.96)
SCL: length 93.3
  Top Layer w0.254: RN2.3 62.96,6.67 v1(63.45,6.19) 61.92,4.66 61.92,1.36 61.57,1 42.01,1 40.41,2.61 CN1.3
  Bottom Layer w0.254: v1(63.45,6.19) 63.78,5.86 64.84,5.86 66.45,7.46 66.45,23.58 62.51,27.52 62.51,29.55 60.52,31.53 46.09,31.53 43.35,28.79 40.04,28.79 39.01,27.77 39.01,26.56 39.66,25.9 40,25.9 ; 40.16,25.96 40.16,25.9 40.13,25.93 40.03,25.93 40,25.9 ; 40,25.9 38.69,24.59 MPU6050.23
SDA: length 91.7
  Top Layer w0.254: 64.72,6.59 62.28,4.15 62.28,1.21 61.72,0.65 41.87,0.65 40.05,2.46 40.05,2.48 39.34,2.48 39.16,2.66 CN1.4 ; 64.72,6.59 64.72,8.49 RN2.4
  Bottom Layer w0.254: 36.77,24.09 39.63,24.09 41.45,25.9 ; 41.45,25.9 41.38,25.98 ; 41.45,25.9 44.23,25.9 45.57,27.24 45.57,29.96 46.79,31.18 60.37,31.18 62.15,29.4 62.15,27.37 66.09,23.43 66.09,7.99 64.74,6.64 v1(64.69,6.64)
$1N2: length 12.4
  Top Layer w0.254: RN3.5 59.1,8.85 v1(59.97,9.71) 60.4,10.15 63.17,10.15 63.76,10.74 63.76,11.25 ; NOREF#12.6 64.3,11.25 63.76,11.25 ; 63.76,11.25 63.76,13.14 LU9685.16
  Bottom Layer w0.254: 59.89,9.64 v1(59.97,9.71)
$1N6832: length 1.9
  Top Layer w0.254: 62.16,11.25 62.16,13.14 62.13,13.17
$1N6846: length 1.9
  Top Layer w0.254: 61.36,11.25 61.33,11.28 LU9685.13
$1N6878: length 14.7
  Top Layer w0.254: NOREF#22.6 65.56,11.52 65.05,11.52 64.44,12.13 64.44,13.96 63.98,14.41 63.42,14.41 62.93,13.93 LU9685.15 62.96,13.14 62.96,10.75 62.76,10.55 v1(59.97,10.55) ; v1(58.8,9.69) 58.76,9.65 RN3.6
  Bottom Layer w0.254: v1(58.8,9.69) 59.1,9.69 v1(59.97,10.55)
$1N9487: length 1.3
  Top Layer w0.254: IP2326.20 IP2326.19 12.9,16.54 v1(12.98,16.46)
$1N9489: length 4.9
  Top Layer w0.254: v1(10.64,14.52) 10.2,14.96 IP2326.14
  Bottom Layer w0.508: v1(10.64,14.52) 9.76,15.4 9.76,15.87 9.1,16.52 C11.2
$1N9490: length 2.9
  Top Layer w0.254: IP2326.16 IP2326.15 ; IP2326.16 11.2,15.99 ; IP2326.16 IP2326.17
  Bottom Layer w0.508: v1(11.05,15.43) 11.05,16.03 C11.1
$1N9492: length 4
  Top Layer w0.254: v1(9.07,15.08) 9.7,15.71 IP2326.13
  Bottom Layer w0.508: R17.1 10.39,13.75 v1(9.07,15.08)
$1N9496: length 2.6
  Bottom Layer w0.254: USB1.B5 5.62,20.24 5.03,20.83 v1(3.99,20.83)
$1N9497: length 2.8
  Bottom Layer w0.254: USB1.A5 5.18,17.24 3.99,18.43
  vias: v2(3.89,18.41)
$1N9501: length 6.7
  Top Layer w0.254: NTC.2 6.98,24.42 8.76,24.42 10.7,22.48 IP2326.4
$1N9502: length 22.6
  Top Layer w0.254: v2(3.02,14.67) 3.02,13.85 R11.2 ; IP2326.5 10.2,22.12 v1(9.22,23.1)
  Bottom Layer w0.254: v2(3.02,14.67) 3.02,15.84 2.16,16.7 2.16,21.68 3.12,22.64 3.12,23.56 4.44,24.88 7.44,24.88 v1(9.22,23.1)
$1N9503: length 20.8
  Top Layer w0.254: IP2326.6 9.7,21.76 v1(8.36,23.1) ; v2(3.78,15.08) 3.78,14.47 3.48,14.16 3.48,12.73 R12.2
  Bottom Layer w0.254: v2(3.78,15.08) 3.78,15.89 2.61,17.06 2.61,21.57 3.49,22.45 3.49,23.31 4.65,24.47 6.98,24.47 8.35,23.1 v1(8.36,23.1)
$1N9504: length 2.6
  Top Layer w0.254: v1(3.51,10.04) 3.53,10.06 R12.1
  Bottom Layer w0.254: v1(3.51,10.04) 3.51,10.15 R.2
$1N9505: length 2.2
  Top Layer w0.254: v1(2.18,10.04) 2.18,10.84 R11.1
  Bottom Layer w0.254: v1(2.18,10.04) 2.55,9.67 G.2
$1N9508: length 7.9
  Top Layer w0.254: 2.45,15.79 4.19,15.79 4.9,16.5 4.9,17.11 6.02,18.22 8.99,18.22 IP2326.10
$1N9510: length 6.6
  Top Layer w0.254: 9,19.24 3.33,19.24 3.17,19.39 RUV.2
$1N9511: length 7.1
  Top Layer w0.254: ROT.2 3.83,19.74 IP2326.7
$1N9512: length 10.1
  Top Layer w0.254: v2(4.09,13.81) 4.29,14.01 4.29,14.62 4.7,15.02 5.87,15.02 6.22,15.38 6.22,17.31 6.65,17.74 IP2326.11
  Bottom Layer w0.254: v2(4.09,13.81) 3.02,12.74 RISET.2
$1N9513: length 2
  Top Layer w0.254: R10.2 7.49,17.1 7.63,17.24 IP2326.12
$1N13576: length 7
  Top Layer w0.254: IP2326.9 8.99,18.73 5.82,18.73 4.7,17.62 ROV.2
$1N15007: length 2.2
  Top Layer w0.635: ACS712.6 42.96,28.11 C6.1
$1N16837: length 12.3
  Top Layer w0.254: IP2326.3 11.2,22.8 9.14,24.85 8.03,24.85 7.8,25.08 3.22,25.08 RVSET.1
$1N21828: length 1.5
  Bottom Layer w0.254: 38.28,26.06 38.25,26.09 36.77,26.09
$1N21877: length 4.9
  Bottom Layer w0.254: 30.54,25.95 30.54,27.72 33.13,27.72 MPU6050.13
$1N25378: length 2.9
  Bottom Layer w0.254: 30.49,24.17 30.71,24.17 32.13,25.59 MPU6050.10
$1N28770: length 25.1
  Bottom Layer w0.762: CN2.3 20.06,16.42 15.82,12.18 15.82,8.83 14.6,7.61 9.83,7.61 8.56,8.88 8.56,10.36 7.08,11.84 6,11.84
$1N32352: length 1.6
  Top Layer w0.584: 18.72,2.55 U1.6
$1N32353: length 3.2
  Top Layer w0.533: U1.4 R5.2 17.02,11.01 R6.1
$1N32354: length 2
  Top Layer w0.508: U1.8 21.26,3.36 C3.2
$1N32356: length 2.8
  Top Layer w0.533: R4.1 19.99,10.98 U1.2
$1N32357: length 1.5
  Top Layer w0.533: 18.72,10.93 U1.3
$1N32372: length 3.3
  Top Layer w0.254: C4.1 18.72,12.36 19.43,13.07 R19.1
$1N32978: length 2.2
  Top Layer w0.254: R21.2 11.89,25.44 11.63,25.44 10.5,26.57 AP62600S.6
$1N33225: length 5.2
  Top Layer w0.254: U63.1 13.8,27.64 C40.1 11.42,28.26 AP62600S.8
$1N35395: length 1.2
  Top Layer w0.508: R23.1 R22.2
$1N42685: length 2.6
  Top Layer w0.254: PWM.1 9.27,25.52 PFM.2 9.5,25.85 AP62600S.4
$1N42697: length 20.9
  Top Layer w0.254: PWM.2 11.81,24.65 11.94,24.52 13.18,23.28 17.93,23.28 18.59,23.94 18.59,28.79 17.51,29.88 C39.1
$1N46249: length 2.3
  Top Layer w0.254: R7.2 23.31,11.32 24.51,12.51 LED1.1

## Copper pours and planes (outline as drawn; the poured copper is in the pictures)
5V on Top Layer: 20.85,29.32 36.91,29.32 36.91,23.71 20.85,23.71
+5V on Top Layer: 34.26,31.71 47.8,31.71 47.8,27.22 34.26,27.22
DVCC on Top Layer: 23.9,10.71 30.35,10.71 30.35,4.28 23.9,4.28
DVCC on Bottom Layer: 37.16,4.03 41.63,4.03 41.63,1.51 37.16,1.51
DVCC on Bottom Layer: 28.98,8.87 38.23,8.87 38.23,0.32 28.98,0.32
DVCC on Bottom Layer: 41.63,8.33 54.96,8.33 54.96,3.01 41.63,3.01
VIN on Top Layer: 14.76,21.27 20.47,21.27 20.47,18.64 14.76,18.64
VIN on Bottom Layer: 12.69,21.78 19.63,21.78 19.63,20.44 12.69,20.44
VIN on Bottom Layer: 7.21,20.89 15.25,20.89 15.25,16.09 7.21,16.09
VIN on Bottom Layer: 16.16,20.49 19.63,20.49 19.63,18.66 16.16,18.66
VIN on Bottom Layer: 8.38,13.87 10.84,13.87 10.84,11.43 8.38,11.43
BAT on Top Layer: 12.42,13.47 13.41,13.47 13.41,12.38 12.42,12.38
BAT on Top Layer: 12.9,18.88 14.45,18.88 14.45,17.31 12.9,17.31
BAT+ on Top Layer: 15.01,3.59 20.27,3.59 20.27,0.34 15.01,0.34
BAT+ on Top Layer: 4.52,27.92 10.01,27.92 10.01,25.36 4.52,25.36
BAT+ on Bottom Layer: 4.52,27.88 24.68,27.88 24.68,17.23 4.52,17.23
BAT+ on Bottom Layer: 15.08,7.94 16.46,7.94 16.46,5.52 15.08,5.52
P_GND on Top Layer: -1.47,33.9 68.71,33.9 68.71,-1.57 -1.47,-1.57
P_GND on Top Layer: 8.63,13.75 11.4,13.75 11.4,10.53 8.63,10.53
P_GND on Top Layer: 17.16,7.94 18.05,7.94 18.05,4.97 17.16,4.97
P_GND on Top Layer: 4.55,30.54 8.61,30.54 8.61,28.18 4.55,28.18
P_GND on Top Layer: 7.67,31.17 12.47,31.17 12.47,28.13 7.67,28.13
P_GND on Bottom Layer: 24.26,7.58 32.31,7.58 32.31,2.84 24.26,2.84
P_GND on Bottom Layer: -0.92,33.46 68.5,33.46 68.5,-1.23 -0.92,-1.23
$1N9490 on Top Layer: 10.56,16.55 20.05,16.55 20.05,14.62 10.56,14.62
$1N28770 on Bottom Layer: 6.5,13.09 16.73,13.09 16.73,7.33 6.5,7.33
$1N32350 on Top Layer: 21.51,10.3 25.68,10.3 25.68,0.6 21.51,0.6
$1N32894 on Top Layer: 7.26,27.32 9.17,27.32 9.17,26.33 7.26,26.33
$1N33107 on Top Layer: 10.16,27.92 12.7,27.92 12.7,26.1 10.16,26.1
$1N33225 on Top Layer: 11.63,29.17 17.83,29.17 17.83,24.02 11.63,24.02
$1N35395 on Top Layer: 8.37,30.75 9.17,30.75 9.17,29.27 8.37,29.27
$1N42697 on Top Layer: 10.36,30.32 12.67,30.32 12.67,29.22 10.36,29.22

Small or netless copper shapes (teardrops, artwork), in the pictures only: 100 on Top Layer, 23 on Bottom Layer

## Text on the board
Bottom Silkscreen Layer: D-0x80 | 0x01-0X1F | A2 | A4 | A3 | A1 | A0 | https://github.com/S4NTH174UN9 | Security KAME V1.1
Top Silkscreen Layer: SDA | SCL | S12-20 | S10
